# Altium schematic sheet [03] - MCU,CONTROLS.SchDoc (part 1 of 2)
size A3; DocumentNumber: 3; SheetNumber: 3; SheetTotal: 8
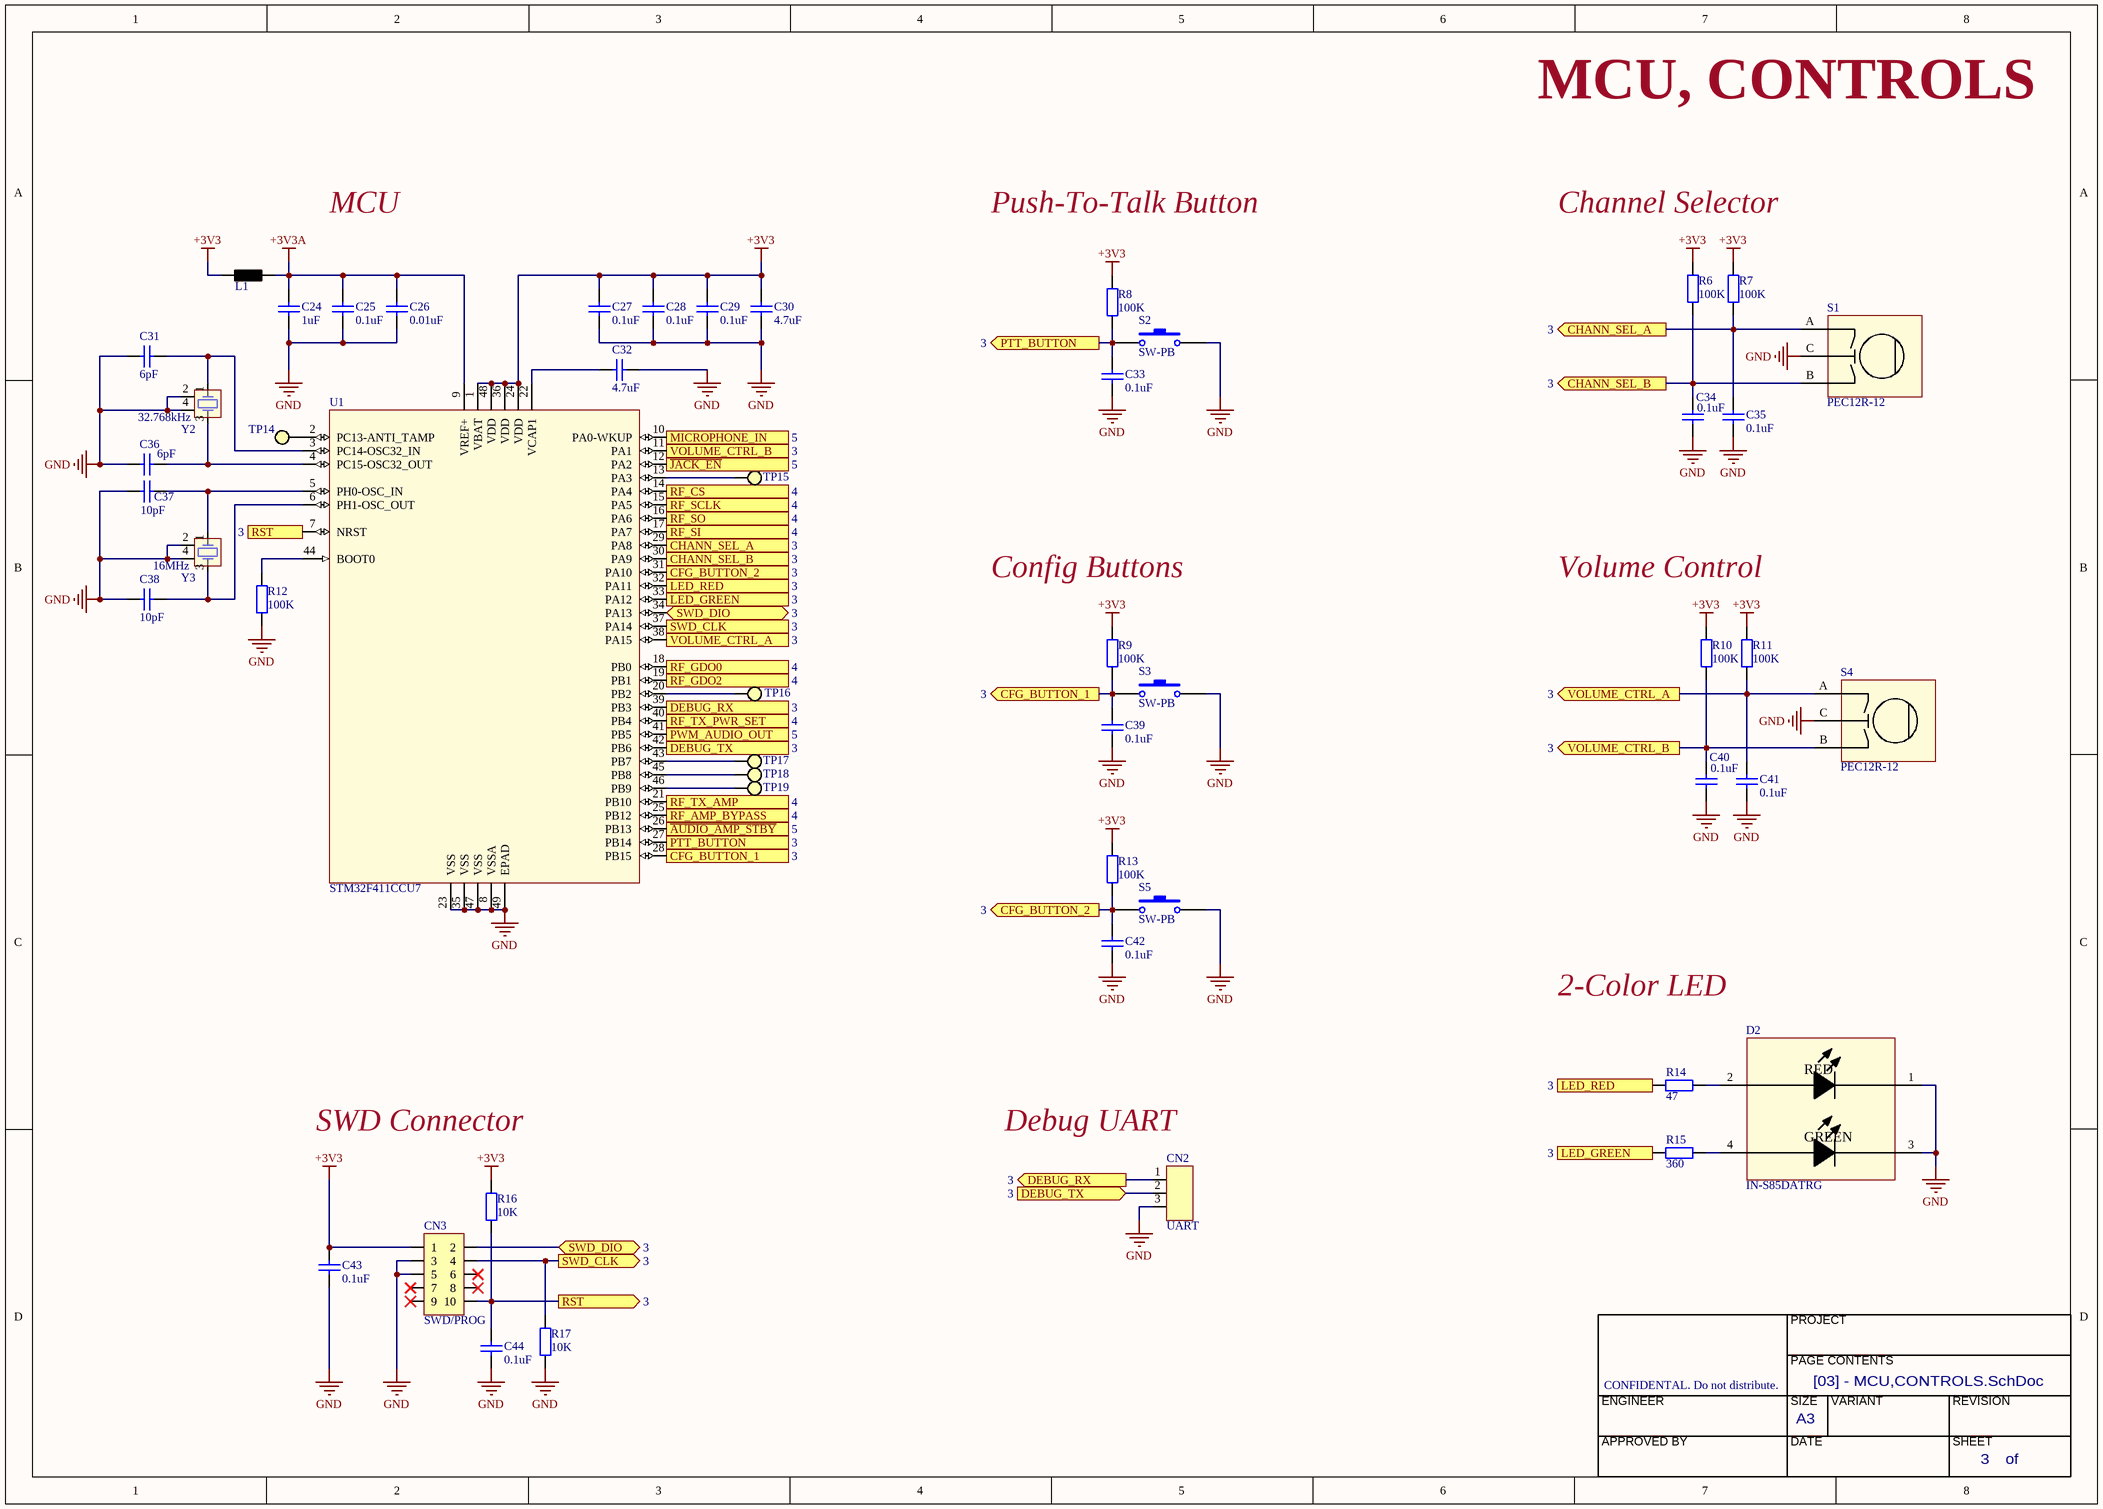
[diagram p0: [03] - MCU,CONTROLS.SchDoc]

## Parts
C24  1uF  [CAP0603]
C25  0.1uF  [CAP0603]
C26  0.01uF  [CAP0603]
C27  0.1uF  [CAP0603]
C28  0.1uF  [CAP0603]
C29  0.1uF  [CAP0603]
C30  4.7uF  [CAP0603]
C31  6pF  [CAP0603]
C32  4.7uF  [CAP0603]
C33  0.1uF  [CAP0603]
C34  0.1uF  [CAP0603]
C35  0.1uF  [CAP0603]
C36  6pF  [CAP0603]
C37  10pF  [CAP0603]
C38  10pF  [CAP0603]
C39  0.1uF  [CAP0603]
C40  0.1uF  [CAP0603]
C41  0.1uF  [CAP0603]
C42  0.1uF  [CAP0603]
C43  0.1uF  [CAP0603]
C44  0.1uF  [CAP0603]
CN2  UART  [H-D-1x3]
CN3  SWD/PROG  [CONN_3220-10-0100-00]
D2  IN-S85DATRG  [INS128DATRG]
L1  BLM18KG601SN1D  [RES0603]  (value not drawn)
R6  100K  [RES0603]
R7  100K  [RES0603]
R8  100K  [RES0603]
R9  100K  [RES0603]
R10  100K  [RES0603]
R11  100K  [RES0603]
R12  100K  [RES0603]
R13  100K  [RES0603]
R14  47  [RES0603]
R15  360  [RES0603]
R16  10K  [RES0603]
R17  10K  [RES0603]
S1  PEC12R-12
S2  SW-PB  [ButtonSmall]
S3  SW-PB  [ButtonSmall]
S4  PEC12R-12
S5  SW-PB  [ButtonSmall]
TP14  TestPoint  [TestPoint]  (value not drawn)  (no BOM)
TP15  TestPoint  [TestPoint]  (value not drawn)  (no BOM)
TP16  TestPoint  [TestPoint]  (value not drawn)  (no BOM)
TP17  TestPoint  [TestPoint]  (value not drawn)  (no BOM)
TP18  TestPoint  [TestPoint]  (value not drawn)  (no BOM)
TP19  TestPoint  [TestPoint]  (value not drawn)  (no BOM)
U1  STM32F411CCU7
Y2  32.768kHz  [ABM3B]
Y3  16MHz  [ABM3B]

## Ports
CFG_BUTTON_1 (in, see 3), CFG_BUTTON_1 (out, see 3), CFG_BUTTON_2 (in, see 3), CFG_BUTTON_2 (out, see 3), CHANN_SEL_A (in, see 3), CHANN_SEL_A (out, see 3), CHANN_SEL_B (in, see 3), CHANN_SEL_B (out, see 3), DEBUG_RX (in, see 3), DEBUG_RX (out, see 3), DEBUG_TX (in, see 3), DEBUG_TX (out, see 3), LED_GREEN (in, see 3), LED_GREEN (out, see 3), LED_RED (in, see 3), LED_RED (out, see 3), MICROPHONE_IN (in, see 5), PTT_BUTTON (in, see 3), PTT_BUTTON (out, see 3), PWM_AUDIO_OUT (out, see 5), RF_AMP_BYPASS (out, see 4), RF_CS (out, see 4), RF_GDO0 (in, see 4), RF_GDO2 (in, see 4), RF_SCLK (out, see 4), RF_SI (out, see 4), RF_SO (in, see 4), RF_TX_AMP (out, see 4), RF_TX_PWR_SET (out, see 4), RST (in, see 3), RST (out, see 3), SWD_CLK (in, see 3), SWD_CLK (out, see 3), SWD_DIO (bidir, see 3), VOLUME_CTRL_A (in, see 3), VOLUME_CTRL_A (out, see 3), VOLUME_CTRL_B (in, see 3), VOLUME_CTRL_B (out, see 3), ~{AUDIO_AMP_STBY} (out, see 5), ~{JACK_EN} (in, see 5)

## Nets
+3V3: C27.1 C28.1 C29.1 C30.2 C43.2 CN3.1 L1.2 R6.1 R7.2 R8.1 R9.1 R10.1 R11.2 R13.1 R16.2 U1.1(VBAT) U1.24(VDD) U1.36(VDD) U1.48(VDD)
+3V3A: C24.1 C25.1 C26.1 L1.1 U1.9(VREF+)
GND: C24.2 C25.2 C26.2 C27.2 C28.2 C29.2 C30.1 C31.1 C32.1 C33.1 C34.1 C35.1 C36.1 C37.1 C38.1 C39.1 C40.1 C41.1 C42.1 C43.1 C44.1 CN2.3 CN3.3 CN3.5 D2.1(C_R) D2.3(C_G) R12.1 R17.1 S1.C S2.2 S3.2 S4.C S5.2 U1.8(VSSA) U1.23(VSS) U1.35(VSS) U1.47(VSS) U1.49(EPAD) Y2.2(GND) Y2.4(GND) Y3.2(GND) Y3.4(GND)
~{AUDIO_AMP_STBY}: U1.26(PB13) ; port ~{AUDIO_AMP_STBY}
CFG_BUTTON_1: C39.2 R9.2 S3.1 U1.28(PB15) ; port CFG_BUTTON_1
CFG_BUTTON_2: C42.2 R13.2 S5.1 U1.31(PA10) ; port CFG_BUTTON_2
CHANN_SEL_A: C35.2 R7.1 S1.A U1.29(PA8) ; port CHANN_SEL_A
CHANN_SEL_B: C34.2 R6.2 S1.B U1.30(PA9) ; port CHANN_SEL_B
DEBUG_RX: CN2.1 U1.39(PB3) ; port DEBUG_RX
DEBUG_TX: CN2.2 U1.42(PB6) ; port DEBUG_TX
~{JACK_EN}: U1.12(PA2) ; port ~{JACK_EN}
LED_GREEN: R15.2 U1.33(PA12) ; port LED_GREEN
LED_RED: R14.1 U1.32(PA11) ; port LED_RED
MICROPHONE_IN: U1.10(PA0-WKUP) ; port MICROPHONE_IN
PTT_BUTTON: C33.2 R8.2 S2.1 U1.27(PB14) ; port PTT_BUTTON
PWM_AUDIO_OUT: U1.41(PB5) ; port PWM_AUDIO_OUT
RF_AMP_BYPASS: U1.25(PB12) ; port RF_AMP_BYPASS
RF_CS: U1.14(PA4) ; port RF_CS
RF_GDO0: U1.18(PB0) ; port RF_GDO0
RF_GDO2: U1.19(PB1) ; port RF_GDO2
RF_SCLK: U1.15(PA5) ; port RF_SCLK
RF_SI: U1.17(PA7) ; port RF_SI
RF_SO: U1.16(PA6) ; port RF_SO
RF_TX_AMP: U1.21(PB10) ; port RF_TX_AMP
RF_TX_PWR_SET: U1.40(PB4) ; port RF_TX_PWR_SET
RST: C44.2 CN3.10 R16.1 U1.7(NRST) ; port RST
SWD_CLK: CN3.4 R17.2 U1.37(PA14) ; port SWD_CLK
SWD_DIO: CN3.2 U1.34(PA13) ; port SWD_DIO
VOLUME_CTRL_A: C41.2 R11.1 S4.A U1.38(PA15) ; port VOLUME_CTRL_A
VOLUME_CTRL_B: C40.2 R10.2 S4.B U1.11(PA1) ; port VOLUME_CTRL_B
NetC31_2: C31.2 U1.3(PC14-OSC32_IN) Y2.1(OSC1)
NetC32_2: C32.2 U1.22(VCAP1)
NetC36_2: C36.2 U1.4(PC15-OSC32_OUT) Y2.3(OSC2)
NetC37_2: C37.2 U1.5(PH0-OSC_IN) Y3.1(OSC1)
NetC38_2: C38.2 U1.6(PH1-OSC_OUT) Y3.3(OSC2)
NetD2_2: D2.2(A_R) R14.2
NetD2_4: D2.4(A_G) R15.1
NetR12_2: R12.2 U1.44(BOOT0)
NetTP14_1: TP14.1 U1.2(PC13-ANTI_TAMP)
NetTP15_1: TP15.1 U1.13(PA3)
NetTP16_1: TP16.1 U1.20(PB2)
NetTP17_1: TP17.1 U1.46(PB9)
NetTP18_1: TP18.1 U1.43(PB7)
NetTP19_1: TP19.1 U1.45(PB8)

Not connected (* = marked no-connect by the designer): CN3 6* 7* 8* 9*

## Notes on the sheet
- MCU, CONTROLS
- MCU
- Push-To-Talk Button
- Channel Selector
- Config Buttons
- Volume Control
- 2-Color LED
- SWD Connector
- (near CN2) Debug UART
- (near CN3) CLOCKS (CPU & PCIE)
- PROJECT
- CONFIDENTAL. Do not distribute.
- PAGE CONTENTS
- ENGINEER
- APPROVED BY
- SIZE
- DATE
- A3
- VARIANT
- REVISION
- SHEET
- of
- (in symbol IN-S85DATRG) RED; GREEN